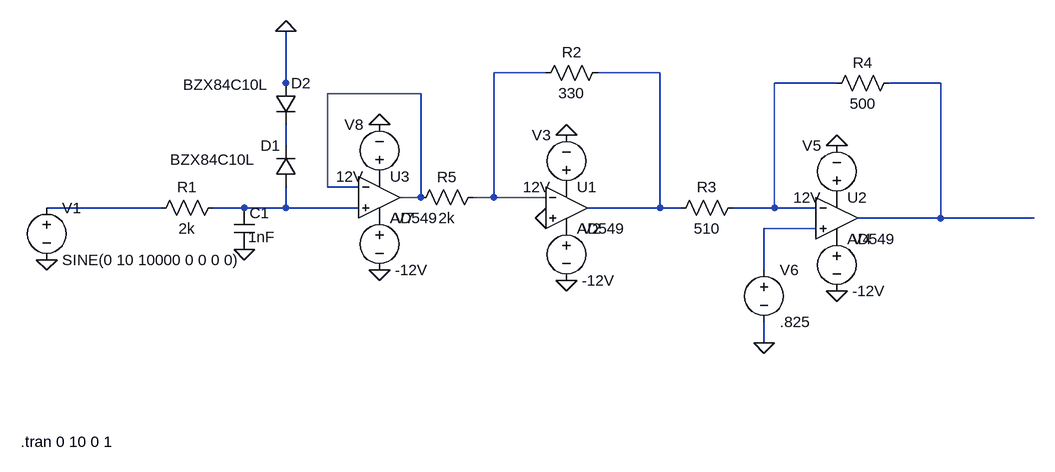
[diagram p0: schematic 10V Circuit Design Final.asc]
10V Circuit Design Final.asc, the LTspice schematic file:
Version 4.1
SHEET 1 1588 680
WIRE 832 -80 752 -80
WIRE 1008 -80 912 -80
WIRE 432 -64 432 -144
WIRE 1280 -64 1184 -64
WIRE 1440 -64 1360 -64
WIRE 432 -48 432 -64
WIRE 640 -48 496 -48
WIRE 432 32 432 0
WIRE 496 96 496 -48
WIRE 544 96 496 96
WIRE 640 112 640 -48
WIRE 640 112 608 112
WIRE 752 112 752 -80
WIRE 752 112 720 112
WIRE 832 112 752 112
WIRE 240 128 64 128
WIRE 368 128 320 128
WIRE 432 128 432 96
WIRE 432 128 368 128
WIRE 544 128 432 128
WIRE 1008 128 1008 -80
WIRE 1008 128 896 128
WIRE 1040 128 1008 128
WIRE 1184 128 1184 -64
WIRE 1184 128 1120 128
WIRE 1248 128 1184 128
WIRE 1440 144 1440 -64
WIRE 1440 144 1312 144
WIRE 1584 144 1440 144
WIRE 1248 160 1168 160
WIRE 1168 224 1168 160
WIRE 1168 336 1168 304
FLAG 864 16 0
FLAG 864 240 0
FLAG 832 144 0
FLAG 1168 336 0
FLAG 1280 256 0
FLAG 1280 32 0
FLAG 64 208 0
FLAG 432 -144 0
FLAG 576 224 0
FLAG 576 0 0
FLAG 368 192 0
SYMBOL voltage 64 112 R0
WINDOW 123 0 0 Left 0
WINDOW 39 0 0 Left 0
SYMATTR InstName V1
SYMATTR Value SINE(0 10 10000 0 0 0 0)
SYMBOL voltage 864 144 R0
WINDOW 123 0 0 Left 0
WINDOW 39 0 0 Left 0
SYMATTR InstName V2
SYMATTR Value -12V
SYMBOL voltage 864 112 R180
WINDOW 0 24 96 Left 2
WINDOW 3 24 16 Left 2
WINDOW 123 0 0 Left 0
WINDOW 39 0 0 Left 0
SYMATTR InstName V3
SYMATTR Value 12V
SYMBOL res 928 -96 R90
WINDOW 0 0 56 VBottom 2
WINDOW 3 32 56 VTop 2
SYMATTR InstName R2
SYMATTR Value 330
SYMBOL res 1136 112 R90
WINDOW 0 0 56 VBottom 2
WINDOW 3 32 56 VTop 2
SYMATTR InstName R3
SYMATTR Value 510
SYMBOL voltage 1280 160 R0
WINDOW 123 0 0 Left 0
WINDOW 39 0 0 Left 0
SYMATTR InstName V4
SYMATTR Value -12V
SYMBOL voltage 1280 128 R180
WINDOW 0 24 96 Left 2
WINDOW 3 24 16 Left 2
WINDOW 123 0 0 Left 0
WINDOW 39 0 0 Left 0
SYMATTR InstName V5
SYMATTR Value 12V
SYMBOL res 1376 -80 R90
WINDOW 0 0 56 VBottom 2
WINDOW 3 32 56 VTop 2
SYMATTR InstName R4
SYMATTR Value 500
SYMBOL voltage 1168 208 R0
WINDOW 123 0 0 Left 0
WINDOW 39 0 0 Left 0
SYMATTR InstName V6
SYMATTR Value .825
SYMBOL diode 448 96 R180
WINDOW 0 24 64 Left 2
WINDOW 3 63 42 Left 2
SYMATTR InstName D1
SYMATTR Value BZX84C10L
SYMBOL diode 416 -64 R0
WINDOW 3 -142 2 Left 2
SYMATTR Value BZX84C10L
SYMATTR InstName D2
SYMBOL OpAmps\\AD549 864 64 R0
SYMATTR InstName U1
SYMBOL OpAmps\\AD549 1280 80 R0
SYMATTR InstName U2
SYMBOL OpAmps\\AD549 576 48 R0
SYMATTR InstName U3
SYMBOL res 336 112 R90
WINDOW 0 0 56 VBottom 2
WINDOW 3 32 56 VTop 2
SYMATTR InstName R1
SYMATTR Value 2k
SYMBOL voltage 576 128 R0
WINDOW 123 0 0 Left 0
WINDOW 39 0 0 Left 0
SYMATTR InstName V7
SYMATTR Value -12V
SYMBOL voltage 576 96 R180
WINDOW 0 24 96 Left 2
WINDOW 3 24 16 Left 2
WINDOW 123 0 0 Left 0
WINDOW 39 0 0 Left 0
SYMATTR InstName V8
SYMATTR Value 12V
SYMBOL res 736 96 R90
WINDOW 0 0 56 VBottom 2
WINDOW 3 32 56 VTop 2
SYMATTR InstName R5
SYMATTR Value 2k
SYMBOL cap 352 128 R0
WINDOW 3 22 45 Left 2
SYMATTR Value 1nF
SYMATTR InstName C1
TEXT 24 488 Left 2 !.tran 0 10 0 1

The netlist it stands for:
* 10V Circuit Design Final.asc
V1 N007 0 SINE(0 10 10000 0 0 0 0)
V2 P001 0 -12V
V3 P002 0 12V
R2 N002 N001 330
R3 N003 N002 510
V4 P003 0 -12V
V5 P004 0 12V
R4 N004 N003 500
V6 N009 0 .825
D1 N008 N006 BZX84C10L
D2 0 N006 BZX84C10L
X§U1 0 N001 P002 P001 N002 AD549  ; pins In+ In- V+ V- OUT
X§U2 N009 N003 P004 P003 N004 AD549  ; pins In+ In- V+ V- OUT
X§U3 N008 N005 P005 P006 N005 AD549  ; pins In+ In- V+ V- OUT
R1 N008 N007 2k
V7 P006 0 -12V
V8 P005 0 12V
R5 N001 N005 2k
C1 N008 0 1nF
.model D D
.lib standard.dio
.tran 0 10 0 1
.backanno
.end